# Altium schematic sheet Board.SchDoc
size A; SheetNumber: 1; SheetTotal: 1
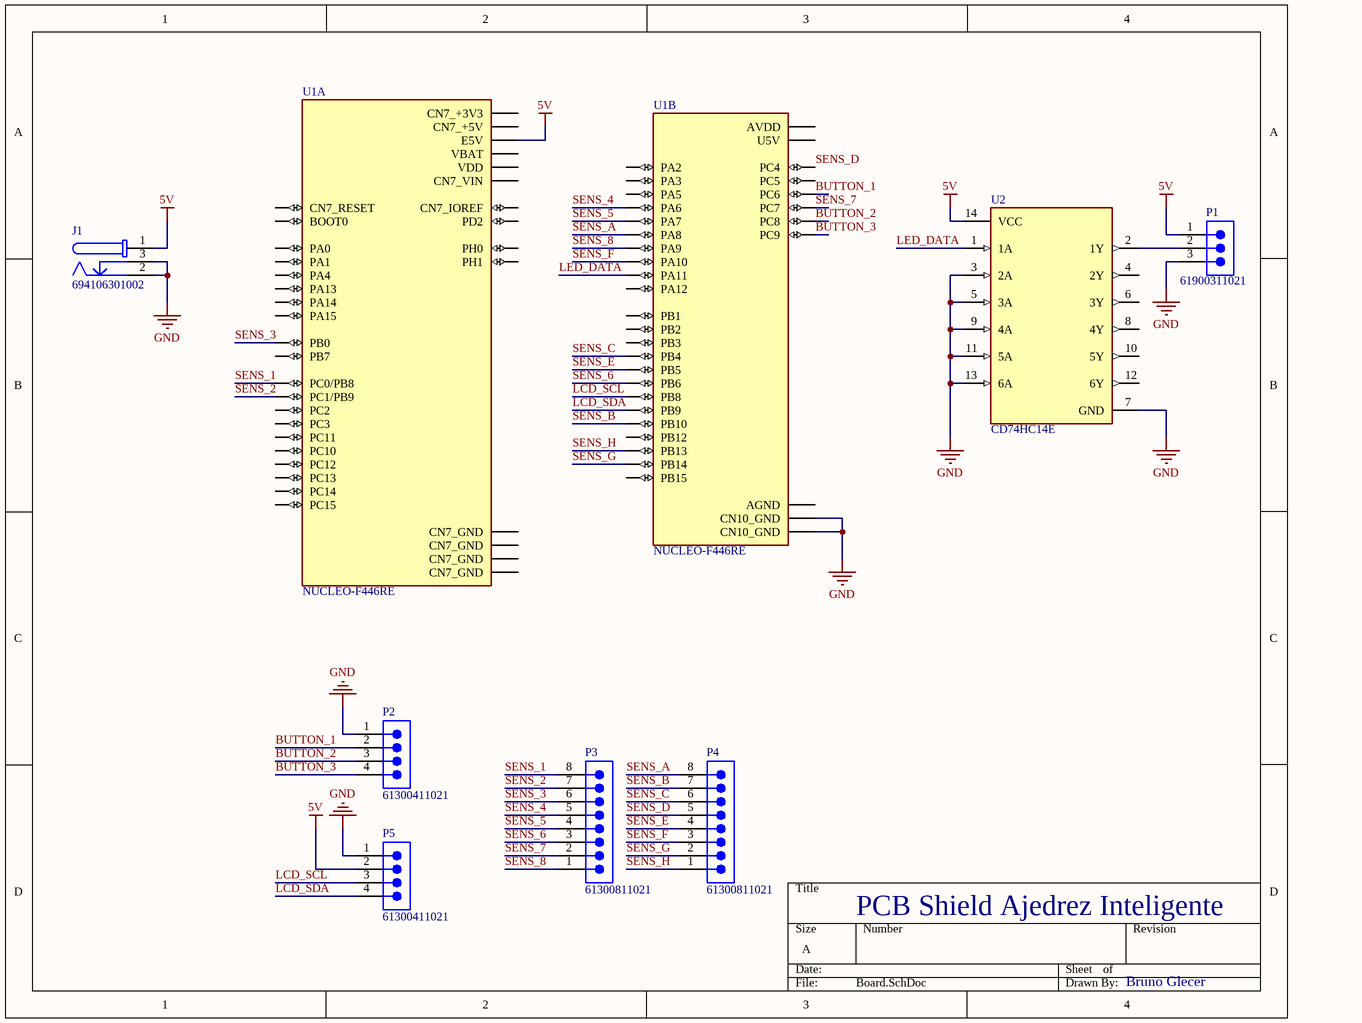
[diagram p0: Board.SchDoc]

## Parts
J1  694106301002  [694106301002]
P1  61900311021  [61900311021]
P2  61300411021  [61300411021]
P3  61300811021  [61300811021]
P4  61300811021  [61300811021]
P5  61300411021  [61300411021]
U1  NUCLEO-F446RE  [MODULE_NUCLEO-F446RE]  (parts A,B of 6)
U2  CD74HC14E  [FP-N0014A-MFG]

## Nets
5V: J1.1 P1.1 P5.2 U1.CN7_6(E5V) U2.14(VCC)
GND: J1.2 J1.3 P1.3 P2.1 P5.1 U1.CN10_9(CN10_GND) U1.CN10_20(CN10_GND) U2.3(2A) U2.5(3A) U2.7(GND) U2.9(4A) U2.11(5A) U2.13(6A)
BUTTON_1: P2.2 U1.CN10_4(PC6)
BUTTON_2: P2.3 U1.CN10_2(PC8)
BUTTON_3: P2.4 U1.CN10_1(PC9)
LCD_SCL: P5.3 U1.CN10_3(PB8)
LCD_SDA: P5.4 U1.CN10_5(PB9)
LED_DATA: U1.CN10_14(PA11) U2.1(1A)
SENS_1: P3.8 U1.CN7_38(PC0/PB8)
SENS_2: P3.7 U1.CN7_36(PC1/PB9)
SENS_3: P3.6 U1.CN7_34(PB0)
SENS_4: P3.5 U1.CN10_13(PA6)
SENS_5: P3.4 U1.CN10_15(PA7)
SENS_6: P3.3 U1.CN10_17(PB6)
SENS_7: P3.2 U1.CN10_19(PC7)
SENS_8: P3.1 U1.CN10_21(PA9)
SENS_A: P4.8 U1.CN10_23(PA8)
SENS_B: P4.7 U1.CN10_25(PB10)
SENS_C: P4.6 U1.CN10_27(PB4)
SENS_D: P4.5 U1.CN10_34(PC4)
SENS_E: P4.4 U1.CN10_29(PB5)
SENS_F: P4.3 U1.CN10_33(PA10)
SENS_G: P4.2 U1.CN10_28(PB14)
SENS_H: P4.1 U1.CN10_30(PB13)
NetP1_2: P1.2 U2.2(1Y)

Not connected (* = marked no-connect by the designer): U1 CN7_1(PC10) CN7_2(PC11) CN7_3(PC12) CN7_4(PD2) CN7_5(VDD) CN7_7(BOOT0) CN7_8(CN7_GND) CN7_12(CN7_IOREF) CN7_13(PA13) CN7_14(CN7_RESET) CN7_15(PA14) CN7_16(CN7_+3V3) CN7_17(PA15) CN7_18(CN7_+5V) CN7_19(CN7_GND) CN7_20(CN7_GND) CN7_21(PB7) CN7_22(CN7_GND) CN7_23(PC13) CN7_24(CN7_VIN) CN7_25(PC14) CN7_27(PC15) CN7_28(PA0) CN7_29(PH0) CN7_30(PA1) CN7_31(PH1) CN7_32(PA4) CN7_33(VBAT) CN7_35(PC2) CN7_37(PC3) CN10_6(PC5) CN10_7(AVDD) CN10_8(U5V) CN10_11(PA5) CN10_12(PA12) CN10_16(PB12) CN10_22(PB2) CN10_24(PB1) CN10_26(PB15) CN10_31(PB3) CN10_32(AGND) CN10_35(PA2) CN10_37(PA3); U2 4(2Y) 6(3Y) 8(4Y) 10(5Y) 12(6Y)

## Notes on the sheet
- PCB Shield Ajedrez Inteligente
- Bruno Glecer

## Library data of the parts
J1 = CMP-1502-00188-2: NexarPartId: 52676100; Voltage Rating (DC): 20V; Gender: Male; Voltage Rating: 24V; Connector Type: Power; Insulation Resistance: 100MΩ; Current Rating: 5A; Shielding: Unshielded; Number of Contacts: 3; Color: Black; Housing Material: Polyamide; Contact Gender: Female; REACH SVHC: Unknown; Termination: Through Hole; Height: 11mm; RoHS: Compliant; Mount: Through Hole; Flammability Rating: UL94 V-0; Packaging: Bulk; Min Operating Temperature: -40°C; Contact Plating: Tin; Max Operating Temperature: 85°C; Operating Supply Voltage: 24V; Contact Material: Gold, Tin
P1 = CMP-1502-00593-2: NexarPartId: 18818221; Number of Positions: 3; Voltage Rating: 250V; Current Rating: 3A; Connector Type: Male Pin; Contact Resistance: 20mΩ; Insulation: Insulated; Insulation Resistance: 1GΩ; Gender: Male; Pitch: 2.54mm; Contact Gender: Male; Color: Beige; Termination: Through Hole; Height: 3.3mm; Max Operating Temperature: 105°C; Min Operating Temperature: -40°C; Mount: Through Hole; Contact Material: Copper; Operating Supply Voltage: 250V; RoHS: Compliant; Lead Pitch: 2.54mm; Contact Mating Length: 7.62mm; Contact Plating: Tin; Number of Contacts: 3; Fastening Type: Friction; Flammability Rating: UL94 V-0; Packaging: Bulk; Number of Pins: 3; Number of Rows: 1; Width: 7.66mm; Housing Material: Nylon; REACH SVHC: Unknown; Length: 7.62mm
P2 P5 = CMP-1502-01063-2: NexarPartId: 31153320; Number of Contacts: 4; Connector Type: Male Pin; Pitch: 2.54mm; Current Rating: 3A; Gender: Male; Contact Resistance: 20mΩ; Operating Supply Voltage: 250V; RoHS: Compliant; Contact Mating Length: 5.9944mm; REACH SVHC: Unknown; Contact Plating: Gold; Lead Pitch: 2.54mm; Mount: Through Hole; Termination: Solder; Number of Positions: 4; Number of Pins: 4; Contact Material: Copper; Color: Black; Number of Rows: 1
P3 P4 = CMP-1502-01075-2: NexarPartId: 32855532; Gender: Male; Number of Contacts: 8; Contact Resistance: 20mΩ; Operating Supply Voltage: 250V; Current Rating: 3A; Pitch: 2.54mm; Connector Type: Male Pin; Termination: Solder; Number of Positions: 8; Contact Material: Copper; Color: Black; Packaging: Bulk; REACH SVHC: Unknown; Lead Pitch: 2.54mm; Number of Rows: 1; Number of Pins: 8; Contact Mating Length: 5.9944mm; RoHS: Compliant; Mount: Through Hole; Contact Plating: Gold
U1 = NUCLEO-F446RE: STM32 Nucleo-64 development board with STM32F446RET6 MCU, supports Arduino and ST morpho connectivity; Price: None; MP: NUCLEO-F446RE; Availability: Unavailable; Value: *; Package: None
U2 = CMP-1615-00903-4: IC INVERTER SCHMITT 6CH 14DIP; Number of Inputs: 1; Number of Gates: 6; Max Supply Voltage: 6V; Schmitt Trigger Input: Yes; Low Level Output Current: 5.2mA; Turn-On Delay Time: 29ns; Logic Function: Buffer; Quiescent Current: 2uA; High Level Output Current: -5.2mA; Max Output Current: 25mA; Min Supply Voltage: 2V; Propagation Delay: 23ns; Input Type: SCHMITT TRIGGER; Mount: Through Hole; REACH SVHC: No SVHC; Technology: CMOS; Case/Package: PDIP; Termination: Through Hole; Height: 4.57mm; Contact Plating: Gold; Weight: 0.032734oz; Package Quantity: 25; Packaging: Rail/Tube; Number of Elements: 6; Width: 6.35mm; RoHS Compliant: Yes; Radiation Hardening: No; Output Current: 5.2mA; Length: 19.3mm; Number of Bits: 6; Lead Free: Lead Free; Number of Pins: 14; Number of Outputs: 6; Series: 74HC; Max Operating Temperature: 125°C; Number of Circuits: 6; Min Operating Temperature: -55°C